# Altium schematic sheet Main.SchDoc
size A4
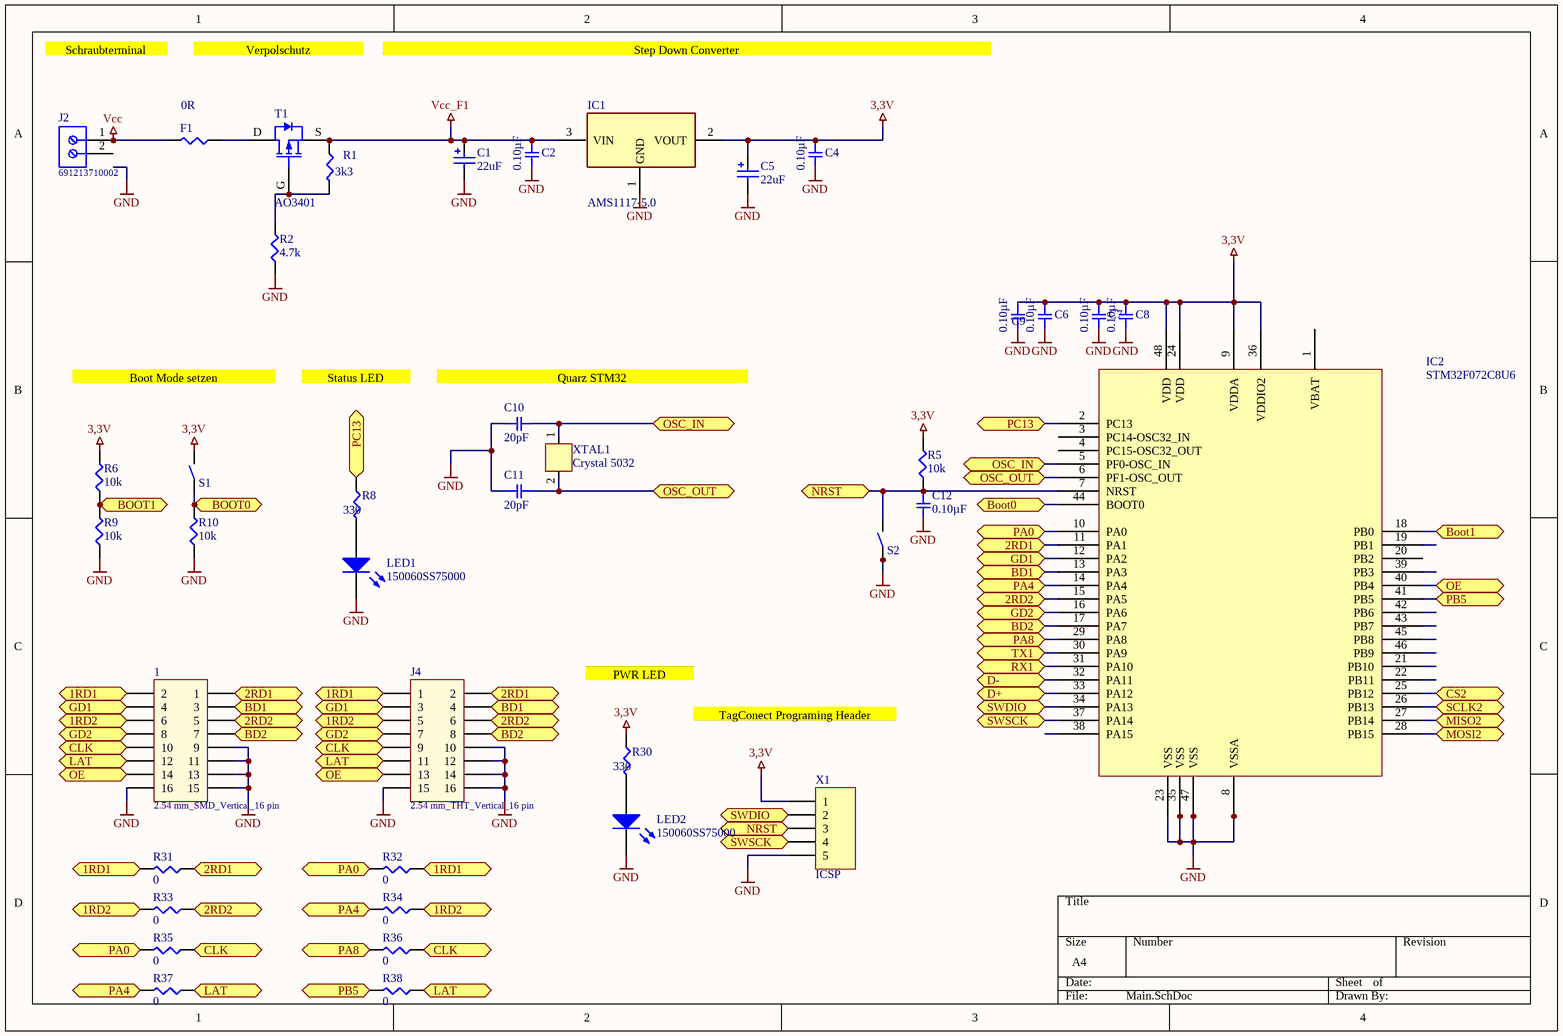
[diagram p0: Main.SchDoc]

## Parts
1  2.54 mm_SMD_Vertical_16 pin  [61001621121]
C1  value 22uF  [WCAP-ASLI_4x5.5]  (hidden comment: 865080140001)
C2  0.10µF  [SMD-0603C]
C4  0.10µF  [SMD-0603C]
C5  value 22uF  [WCAP-ASLI_4x5.5]  (hidden comment: 865080140001)
C6  0.10µF  [SMD-0603C]
C7  0.10µF  [SMD-0603C]
C8  0.10µF  [SMD-0603C]
C9  0.10µF  [SMD-0603C]
C10  20pF  [SMD-0603C]
C11  20pF  [SMD-0603C]
C12  0.10µF  [SMD-0603C]
F1  0R  [SMD-0603-RES]
IC1  AMS1117-5.0  [SOT229P700X180-4N]
IC2  STM32F072C8U6  [LQFP-48]
J2  691213710002  [691213710002]
J4  2.54 mm_THT_Vertical_16 pin  [61301621121]
LED1  150060SS75000  [0603_A]
LED2  150060SS75000  [0603_A]
R1  3k3  [SMD-0603-RES]
R2  4.7k  [SMD-0603-RES]
R5  10k  [SMD-0603-RES]
R6  10k  [SMD-0603-RES]
R8  330  [SMD-0603-RES]
R9  10k  [SMD-0603-RES]
R10  10k  [SMD-0603-RES]
R30  330  [SMD-0603-RES]
R31  0  [SMD-0603-RES]
R32  0  [SMD-0603-RES]
R33  0  [SMD-0603-RES]
R34  0  [SMD-0603-RES]
R35  0  [SMD-0603-RES]
R36  0  [SMD-0603-RES]
R37  0  [SMD-0603-RES]
R38  0  [SMD-0603-RES]
S1  Button  [Button5050]  (value not drawn)
S2  Button  [Button5050]  (value not drawn)
T1  AO3401  [SOT23]
X1  ICSP  [TC2030-MCP-NL]
XTAL1  Crystal 5032  [5032]

## Ports
1RD1 (bidir), 1RD2 (bidir), 2RD1 (bidir), 2RD2 (bidir), BD1 (bidir), BD2 (bidir), Boot0 (bidir), BOOT0 (bidir), Boot1 (bidir), BOOT1 (bidir), CLK (bidir), CS2 (bidir), D+ (bidir), D- (bidir), GD1 (bidir), GD2 (bidir), LAT (bidir), MISO2 (bidir), MOSI2 (bidir), NRST (bidir), OE (bidir), OSC_IN (bidir), OSC_OUT (bidir), PA0 (bidir), PA4 (bidir), PA8 (bidir), PB5 (bidir), PC13 (bidir), RX1 (bidir), SCLK2 (bidir), SWDIO (bidir), SWSCK (bidir), TX1 (bidir)

## Nets
3,3V: C4.1 C5.1(P) C6.1 C7.1 C8.1 C9.1 IC1.2(VOUT) IC2.9(VDDA) IC2.24(VDD) IC2.36(VDDIO2) IC2.48(VDD) R5.2 R6.2 R30.1 S1.2 X1.1
GND: 1.9 1.11 1.13 1.15 1.16 C1.2(N) C2.2 C4.2 C5.2(N) C6.2 C7.2 C8.2 C9.2 C10.1 C11.1 C12.2 IC1.1(GND) IC2.8(VSSA) IC2.23(VSS) IC2.35(VSS) IC2.47(VSS) J4.10 J4.12 J4.14 J4.15 J4.16 LED1.1(K) LED2.1(K) R2.1 R9.1 R10.1 S2.1 X1.5
Vcc: F1.2 J2.1
Vcc_F1: C1.1(P) C2.1 IC1.3(VIN) R1.1 T1.S
1RD1: 1.2 J4.1 R31.2 R32.1 ; port 1RD1
1RD2: 1.6 J4.5 R33.2 R34.1 ; port 1RD2
2RD1: 1.1 IC2.11(PA1) J4.2 R31.1 ; port 2RD1
2RD2: 1.5 IC2.15(PA5) J4.6 R33.1 ; port 2RD2
BD1: 1.3 IC2.13(PA3) J4.4 ; port BD1
BD2: 1.7 IC2.17(PA7) J4.8 ; port BD2
Boot0: IC2.44(BOOT0) R10.2 S1.1 ; port Boot0, port BOOT0
Boot1: IC2.18(PB0) R6.1 R9.2 ; port Boot1, port BOOT1
CLK: 1.10 J4.9 R35.1 R36.1 ; port CLK
CS2: IC2.25(PB12) ; port CS2
D+: IC2.33(PA12) ; port D+
D-: IC2.32(PA11) ; port D-
GD1: 1.4 IC2.12(PA2) J4.3 ; port GD1
GD2: 1.8 IC2.16(PA6) J4.7 ; port GD2
LAT: 1.12 J4.11 R37.1 R38.1 ; port LAT
MISO2: IC2.27(PB14) ; port MISO2
MOSI2: IC2.28(PB15) ; port MOSI2
NRST: C12.1 IC2.7(NRST) R5.1 S2.2 X1.3 ; port NRST
OE: 1.14 IC2.40(PB4) J4.13 ; port OE
OSC_IN: C10.2 IC2.5(PF0-OSC_IN) XTAL1.1 ; port OSC_IN
OSC_OUT: C11.2 IC2.6(PF1-OSC_OUT) XTAL1.2 ; port OSC_OUT
PA0: IC2.10(PA0) R32.2 R35.2 ; port PA0
PA4: IC2.14(PA4) R34.2 R37.2 ; port PA4
PA8: IC2.29(PA8) R36.2 ; port PA8
PB5: IC2.41(PB5) R38.2 ; port PB5
PC13: IC2.2(PC13) R8.1 ; port PC13
RX1: IC2.31(PA10) ; port RX1
SCLK2: IC2.26(PB13) ; port SCLK2
SWDIO: IC2.34(PA13) X1.2 ; port SWDIO
SWSCK: IC2.37(PA14) X1.4 ; port SWSCK
TX1: IC2.30(PA9) ; port TX1
NetF1_1: F1.1 T1.D
NetLED1_2: LED1.2(A) R8.2
NetLED2_2: LED2.2(A) R30.2
NetR1_2: R1.2 R2.2 T1.G

Not connected (* = marked no-connect by the designer): IC2 1(VBAT) 3(PC14-OSC32_IN) 4(PC15-OSC32_OUT) 19(PB1) 20(PB2) 21(PB10) 22(PB11) 38(PA15) 39(PB3) 42(PB6) 43(PB7) 45(PB8) 46(PB9); J2 2

## Notes on the sheet
- Schraubterminal
- Verpolschutz
- Step Down Converter
- Boot Mode setzen
- Status LED
- Quarz STM32
- PWR LED
- TagConect Programing Header

## Library data of the parts
1 = 61001621121: Pin Header WR-PHD, pitch 2.54 mm, SMD, Vertical, dual row, 16 pin; Rated Current: 3 A; Pin Number: 16; Pitch: 2.54 mm; Working Voltage: 250 VAC; Contact Resistance: 20 mOhm; Insulation Resistance: >1000 MOhm; ComponentLink1Description: Manufacturer; ComponentLink1URL: http://www.we-online.de; ComponentLink2Description: Datasheet; ComponentLink2URL: http://katalog.we-online.de/em/datasheet/6100xx21121.pdf; Part Number: 61001621121; Published Date: Jan. 2018; Publisher: Wurth Elektronik; Operating Temperature: -40 to 105 degC; Mounting Technology: SMD; Row Number: Dual; Orientation: Vertical
C1 C5 = 865080140001: WCAP-ASLI Aluminum Electrolytic Capacitors, size Ф4x5.5mm, 6.3V DC, 22uF; Rated Voltage: 6.3V DC; ComponentLink1Description: Manufacturer; ComponentLink1URL: http://www.we-online.de; ComponentLink2Description: Datasheet; ComponentLink2URL: http://katalog.we-online.de/pbs/datasheet/865080140001.pdf; Part Number: 865080140001; Published Date: June 2017; Publisher: Wurth Elektronik; Size: Ф4x5.5mm; Life Cycle: 2000h; Operating Temperature: -55 °C up to +105 °C
C2 C4 C6-C12 = GCM188R71C104KA37J: CAP CER 0.1UF 16V X7R 0603; Manufacturer: Murata Electronics North America; Factory Stock: 0; Unit Price (USD): 0.18; Minimum Quantity: 1; Tolerance: ±10%; Datasheets: http://www.murata.com/~/media/webrenewal/support/library/catalog/products/capacitor/mlcc/c03e.ashx; Image: //media.digikey.com/Renders/Murata%20Renders/0603%28GCM188%29.jpg; Digi-Key Part Number: 490-8015-1-ND; Part Number: GCM188R71C104KA37J; Quantity Available: 17844; @ qty: 0; Packaging: Cut Tape (CT); Series: GCM; Part Status: Active; Voltage: 16V; Temperature Coefficient: X7R; Operating Temperature: -55°C ~ 125°C; Features: -; Ratings: AEC-Q200; Applications: Automotive; Mounting Type: Surface Mount, MLCC; Package / Case: 0603 (1608 Metric); Size / Dimension: 0.063" L x 0.031" W (1.60mm x 0.80mm); Height - Seated (Max): -; Thickness (Max): 0.035" (0.90mm); Lead Spacing: -; Lead Style: -
  C2 C4 C6-C9 C12: Value: 0.10µF
  C10 C11: Value: 20pF
F1 R1 = ERJ-3EKF1001V: RES SMD 1K OHM 1% 1/10W 0603; Manufacturer: Panasonic Electronic Components; Factory Stock: 0; Unit Price (USD): 0.00379; @ qty: 1500; Minimum Quantity: 1; Power (Watts): 0.1W, 1/10W; Temperature Coefficient: ±100ppm/°C; Part Number: ERJ-3EKF1001V; Datasheets: http://industrial.panasonic.com/www-cgi/jvcr13pz.cgi?E+PZ+3+AOA0002+ERJ3EKF1001V+7+WW; Image: //media.digikey.com/Photos/Panasonic%20Photos/MFG_ERJ-P6W%20Series.jpg; Digi-Key Part Number: P1.00KHCT-ND; Quantity Available: 5218845; Packaging: Cut Tape (CT); Series: ERJ; Part Status: Active; Tolerance: ±1%; Composition: Thick Film; Features: Automotive AEC-Q200; Operating Temperature: -55°C ~ 155°C; Package / Case: 0603 (1608 Metric); Supplier Device Package: 0603; Size / Dimension: 0.063" L x 0.031" W (1.60mm x 0.80mm); Height - Seated (Max): 0.022" (0.55mm); Number of Terminations: 2; Failure Rate: -
  F1: Value: 0R
  R1: Value: 3k3
IC1 = AMS1117-5.0: Integrated Circuit; Manufacturer_Name: Advanced Monolithic Systems; Datasheet Link: http://www.advanced-monolithic.com/pdf/ds1117.pdf; Height: 1.8mm; Manufacturer_Part_Number: AMS1117-5.0
J2 = 691213710002: Serie 213 - 5.00 mm Horizontal Entry Modular with RisingCage Clamp WR-TBL, 2 pin; Pin Number: 2; Pitch: 5.00 mm; ComponentLink1Description: Manufacturer; ComponentLink1URL: http://www.we-online.de; ComponentLink2Description: Datasheet; ComponentLink2URL: http://katalog.we-online.de/em/datasheet/6912137100xx.pdf; Part Number: 691213710002; Published Date: June 2018; Publisher: Wurth Elektronik; Operating Temperature: -40 to 105 degC; Mounting Technology: THT; Packaging: Box
J4 = 61301621121: Pin Header WR-PHD, pitch 2.54 mm, THT, Vertical, dual row, 16 pin; Rated Current: 3 A; Pin Number: 16; Pitch: 2.54 mm; Working Voltage: 250 VAC; Contact Resistance: 20 mOhm; Insulation Resistance: >1000 MOhm; ComponentLink1Description: Manufacturer; ComponentLink1URL: http://www.we-online.de; ComponentLink2Description: Datasheet; ComponentLink2URL: http://katalog.we-online.de/em/datasheet/6130xx21121.pdf; Part Number: 61301621121; Published Date: Jan. 2018; Publisher: Wurth Elektronik; Operating Temperature: -40 to 105 degC; Mounting Technology: THT; Row Number: Dual; Orientation: Vertical
LED1 LED2 = 150060SS75000: SMD mono-color Chip LED, WL-SMCW, Super Red; PackageReference: 0603_A; Color: Super Red; PartNumber: 150060SS75000; ComponentLink1Description: Manufacturer URL; ComponentLink1URL: http://www.we-online.com; ComponentLink2Description: Datasheet; ComponentLink2URL: http://katalog.we-online.com/led/datasheet/150060SS75000.pdf
R2 = ERJ-3EKF4701V: RES SMD 4.7K OHM 1% 1/10W 0603; Manufacturer: Panasonic Electronic Components; Factory Stock: 0; Unit Price (USD): 0.00379; @ qty: 1500; Minimum Quantity: 1; Power (Watts): 0.1W, 1/10W; Temperature Coefficient: ±100ppm/°C; Part Number: ERJ-3EKF4701V; Datasheets: http://industrial.panasonic.com/www-cgi/jvcr13pz.cgi?E+PZ+3+AOA0002+ERJ3EKF4701V+7+WW; Image: //media.digikey.com/Photos/Panasonic%20Photos/MFG_ERJ-P6W%20Series.jpg; Digi-Key Part Number: P4.70KHCT-ND; Quantity Available: 999380; Packaging: Cut Tape (CT); Series: ERJ; Part Status: Active; Value: 4.7k; Tolerance: ±1%; Composition: Thick Film; Features: Automotive AEC-Q200; Operating Temperature: -55°C ~ 155°C; Package / Case: 0603 (1608 Metric); Supplier Device Package: 0603; Size / Dimension: 0.063" L x 0.031" W (1.60mm x 0.80mm); Height - Seated (Max): 0.022" (0.55mm); Number of Terminations: 2; Failure Rate: -
R5 R6 R9 R10 = ERJ-3EKF1002V: RES SMD 10K OHM 1% 1/10W 0603; Manufacturer: Panasonic Electronic Components; Factory Stock: 0; Unit Price (USD): 0.00379; @ qty: 1500; Minimum Quantity: 1; Power (Watts): 0.1W, 1/10W; Temperature Coefficient: ±100ppm/°C; Part Number: ERJ-3EKF1002V; Datasheets: http://industrial.panasonic.com/www-cgi/jvcr13pz.cgi?E+PZ+3+AOA0002+ERJ3EKF1002V+7+WW; Image: //media.digikey.com/Photos/Panasonic%20Photos/MFG_ERJ-P6W%20Series.jpg; Digi-Key Part Number: P10.0KHCT-ND; Quantity Available: 6703141; Packaging: Cut Tape (CT); Series: ERJ; Part Status: Active; Value: 10k; Tolerance: ±1%; Composition: Thick Film; Features: Automotive AEC-Q200; Operating Temperature: -55°C ~ 155°C; Package / Case: 0603 (1608 Metric); Supplier Device Package: 0603; Size / Dimension: 0.063" L x 0.031" W (1.60mm x 0.80mm); Height - Seated (Max): 0.022" (0.55mm); Number of Terminations: 2; Failure Rate: -
R8 R30 = ERJ-3EKF3300V: RES SMD 330 OHM 1% 1/10W 0603; Manufacturer: Panasonic Electronic Components; Factory Stock: 0; Unit Price (USD): 0.00379; @ qty: 1500; Minimum Quantity: 1; Power (Watts): 0.1W, 1/10W; Temperature Coefficient: ±100ppm/°C; Part Number: ERJ-3EKF3300V; Datasheets: http://industrial.panasonic.com/www-cgi/jvcr13pz.cgi?E+PZ+3+AOA0002+ERJ3EKF3300V+7+WW; Image: //media.digikey.com/Photos/Panasonic%20Photos/MFG_ERJ-P6W%20Series.jpg; Digi-Key Part Number: P330HCT-ND; Quantity Available: 670984; Packaging: Cut Tape (CT); Series: ERJ; Part Status: Active; Value: 330; Tolerance: ±1%; Composition: Thick Film; Features: Automotive AEC-Q200; Operating Temperature: -55°C ~ 155°C; Package / Case: 0603 (1608 Metric); Supplier Device Package: 0603; Size / Dimension: 0.063" L x 0.031" W (1.60mm x 0.80mm); Height - Seated (Max): 0.022" (0.55mm); Number of Terminations: 2; Failure Rate: -
R31-R38 = ERJ-3EKF1002V: RES SMD 10K OHM 1% 1/10W 0603; Manufacturer: Panasonic Electronic Components; Unit Price (USD): 0.00379; @ qty: 1500; Minimum Quantity: 1; Power (Watts): 0.1W, 1/10W; Temperature Coefficient: ±100ppm/°C; Part Number: ERJ-3EKF1002V; Datasheets: http://industrial.panasonic.com/www-cgi/jvcr13pz.cgi?E+PZ+3+AOA0002+ERJ3EKF1002V+7+WW; Image: //media.digikey.com/Photos/Panasonic%20Photos/MFG_ERJ-P6W%20Series.jpg; Digi-Key Part Number: P10.0KHCT-ND; Quantity Available: 6703141; Factory Stock: 0; Packaging: Cut Tape (CT); Series: ERJ; Part Status: Active; Value: 0; Tolerance: ±1%; Composition: Thick Film; Features: Automotive AEC-Q200; Operating Temperature: -55°C ~ 155°C; Package / Case: 0603 (1608 Metric); Supplier Device Package: 0603; Size / Dimension: 0.063" L x 0.031" W (1.60mm x 0.80mm); Height - Seated (Max): 0.022" (0.55mm); Number of Terminations: 2; Failure Rate: -
S1 S2 = Button: 6.1x3.7x2.5mm
T1 = AO3401: AO3401 MOSFET 30V
XTAL1 = 5032